# EAGLE design supply (EAGLE 6.3)
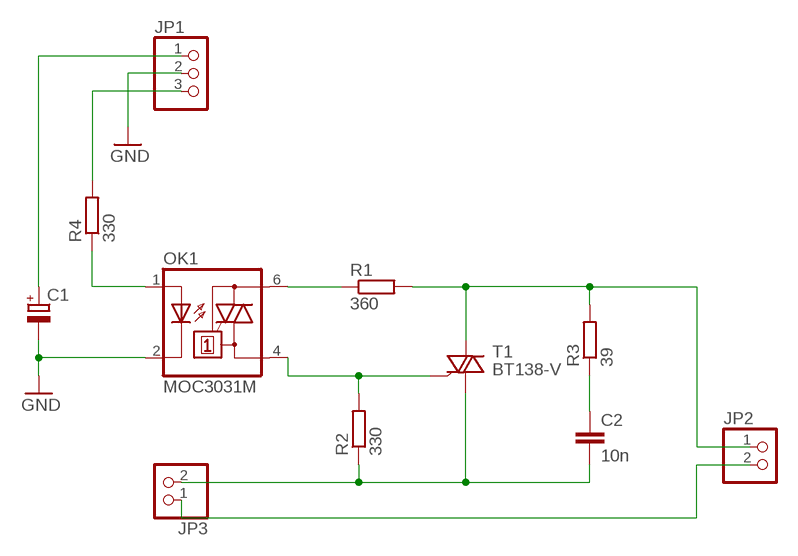
[diagram p0: schematic, sheet 1]

## Parts
C1  CPOL-EUE5-10.5  [E5-10,5]
C2  10n  C-EU102-064X133  [C102-064X133]
JP1  PINHD-1X3  [1X03]
JP2  PINHD-1X2  [1X02]
JP3  PINHD-1X2  [1X02]
OK1  MOC3031M  [DIL06]
R1  360  R-EU_0207/10  [0207/10]
R2  330  R-EU_0207/10  [0207/10]
R3  39  R-EU_0207/10  [0207/10]
R4  330  R-EU_0207/10  [0207/10]
T1  BT138-V  [TO220BV]

## Nets
GND: C1.- JP1.2 OK1.2(C)
N$1: OK1.1(A) R4.1
N$2: OK1.6(A2) R1.1
N$3: JP2.1 R1.2 R3.2 T1.T2(A2)
N$4: OK1.4(A1) R2.2 T1.G
N$5: C2.2 JP3.2 R2.1 T1.T1(A1)
N$6: C2.1 R3.1
N$7: JP1.3 R4.2
N$8: C1.+ JP1.1
N$9: JP2.2 JP3.1

## Library data of the parts
C1 = resistor:CPOL-EU: POLARIZED CAPACITOR, European symbol
C2 = resistor:C-EU: CAPACITOR, European symbol
JP1 = pinhead:PINHD-1X3: PIN HEADER
JP2 JP3 = pinhead:PINHD-1X2: PIN HEADER
OK1 = optocoupler:MOC30*: 6-Pin DIP Zero-Cross Optoisolators Triac Driver Output (250/400 Volt Peak) Source: http://www.fairchildsemi.com/ds/MO/MOC3043-M.pdf; MF: FAIRCHILD SEMICONDUCTOR; MPN: MOC3031M; OC_FARNELL: 9875964; OC_NEWARK: 78K6089
R1-R4 = resistor:R-EU_: RESISTOR, European symbol
T1 = triac:BT138: TRIAC Source: http://www.semiconductors.philips.com BT138_SERIES_2.pdf

## Board
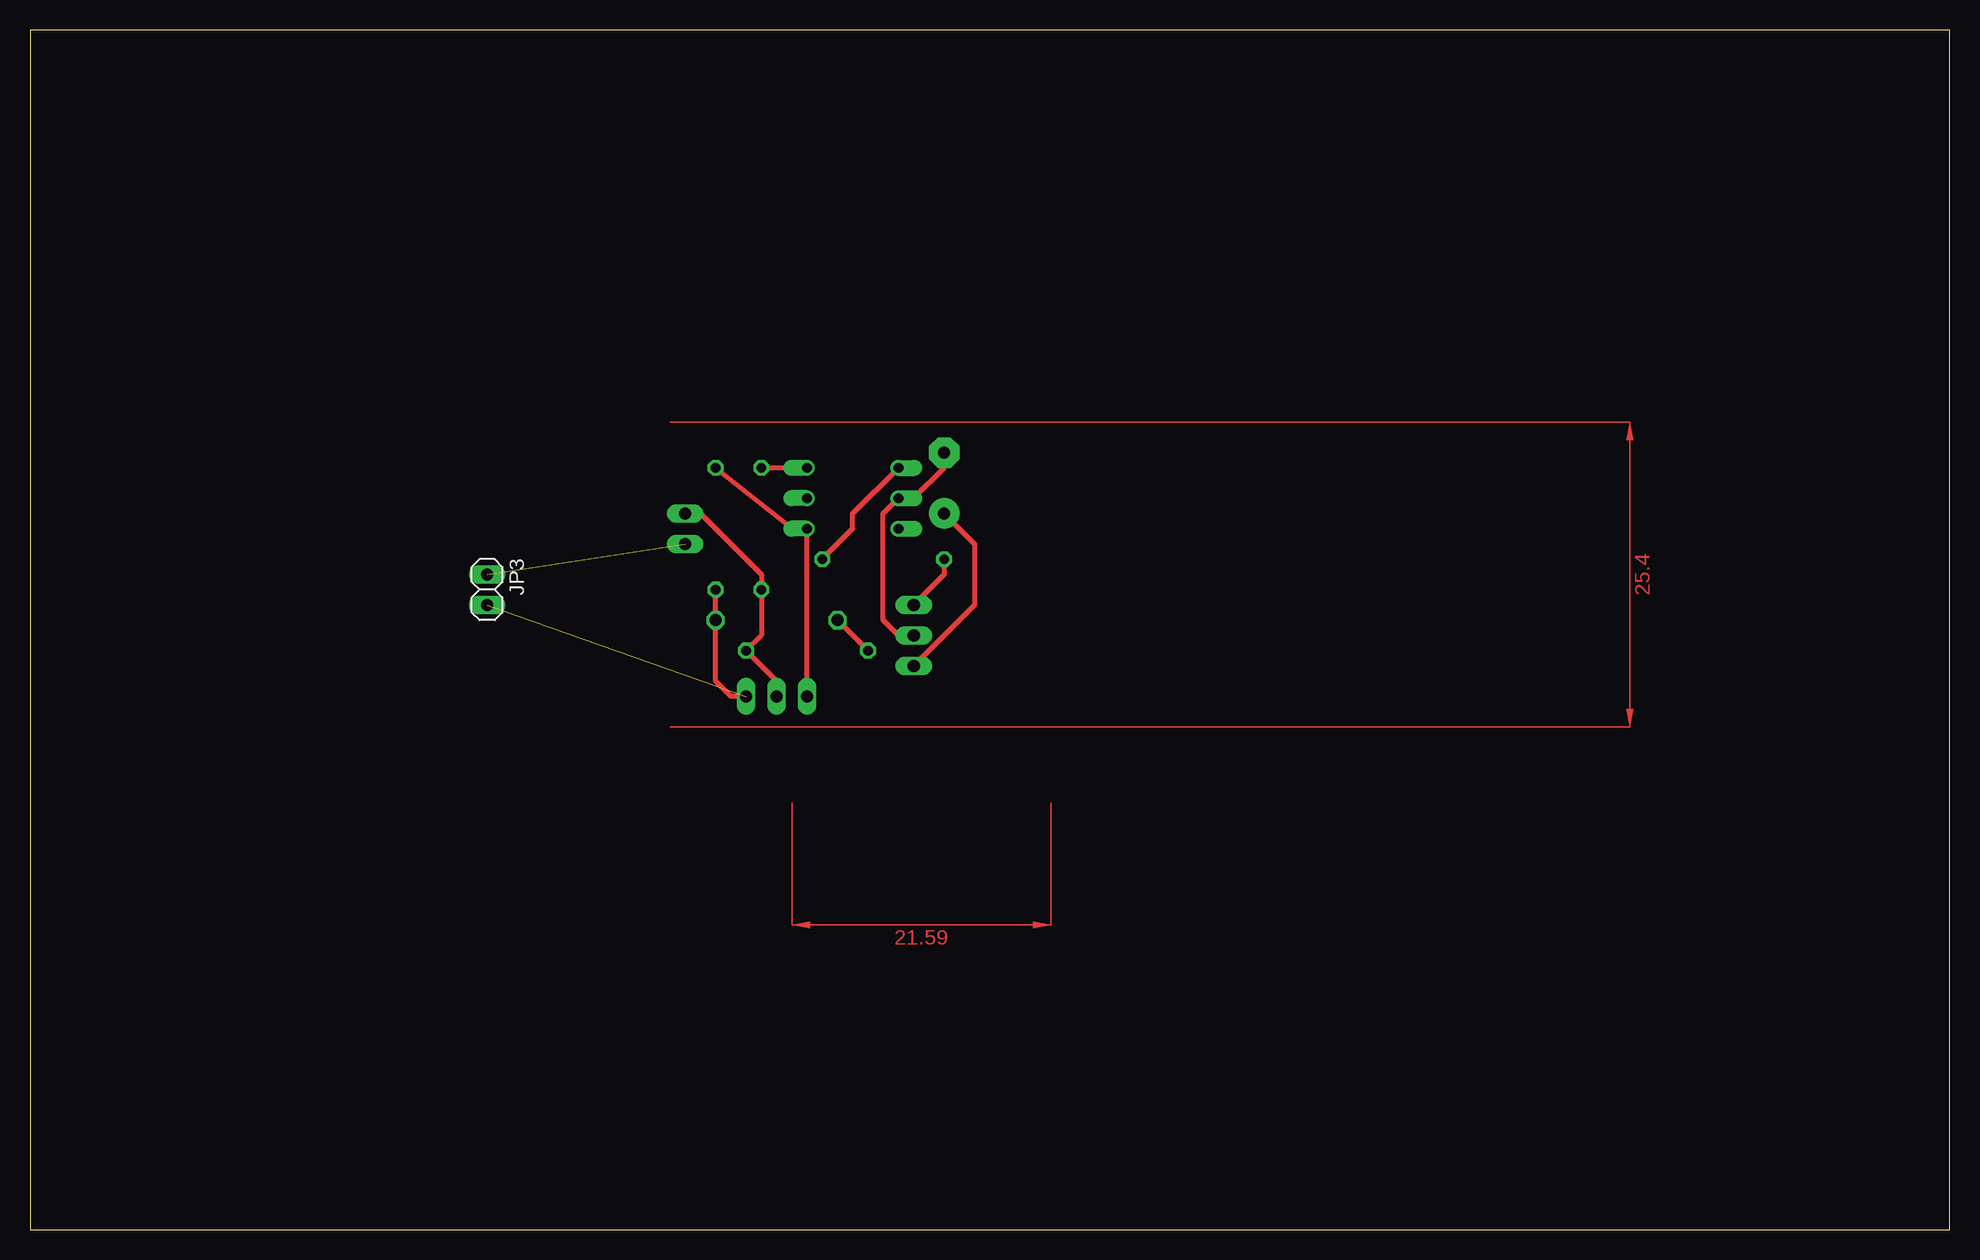
[diagram p1: board, top side]
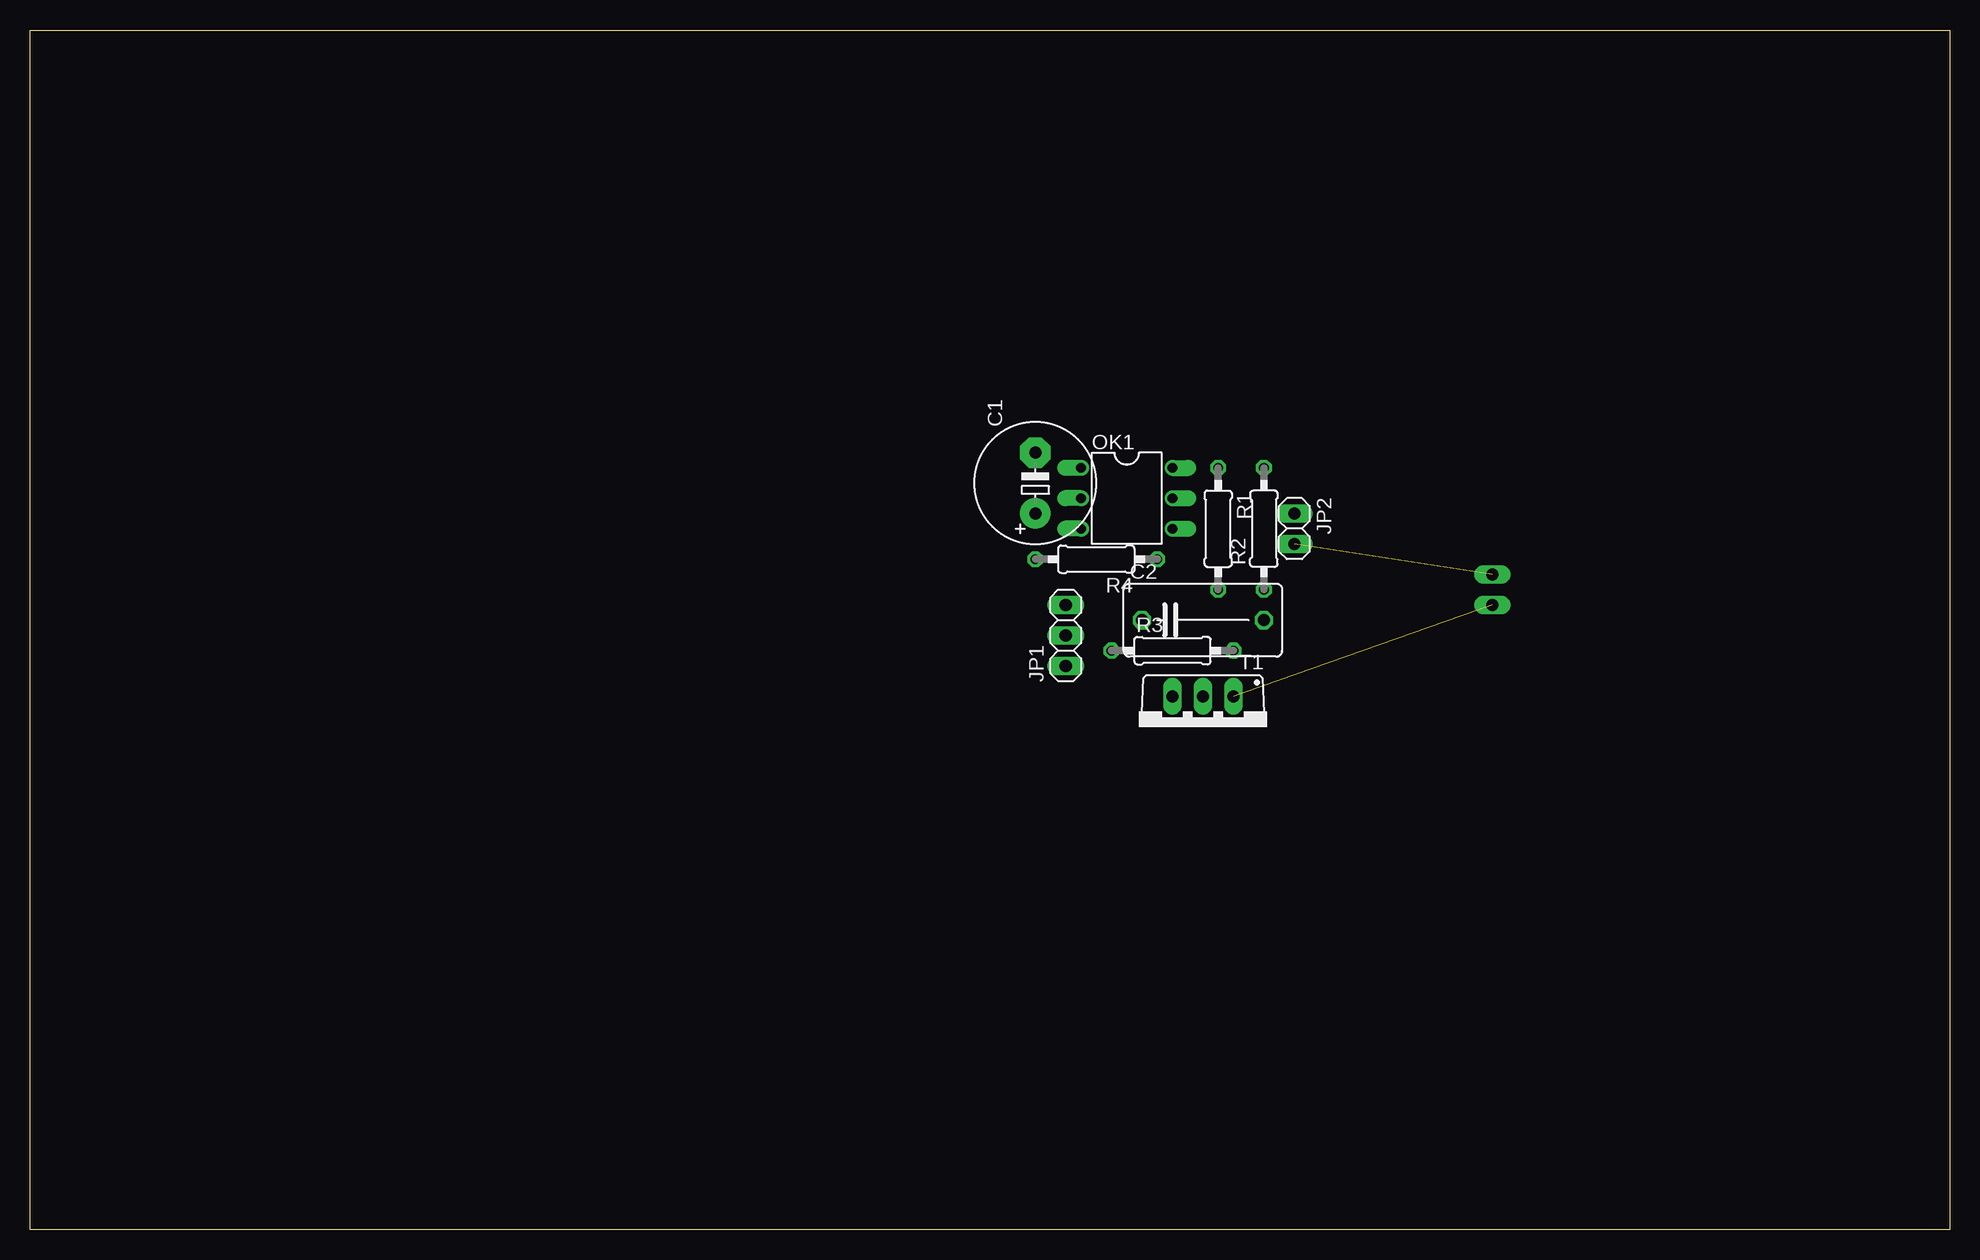
[diagram p2: board, bottom side, seen from below]

Size 160 x 100 mm. Coordinates in mm from the lower left corner, seen from the top.
Outline: 0,0 160,0 160,100 0,100 0,0
Copper layers (1*16): Top 0.035mm / dielectric 1.5mm / Bottom 0.035mm
Design rules "default": minimum track width 10mil, minimum drill 24mil, track to track 8mil, track to pad 8mil, pad to pad 8mil, via to via 8mil, smd to smd 8mil, copper to edge 40mil, drill to drill 8mil, minimum pad ring 10mil, minimum via ring 8mil, stop-mask expansion 4mil, vias tented up to drill 0mil, thermal gap 10mil

### Footprints (pad centres in the part's own frame; a part is rotated, then mirrored left to right if it is on the bottom)
E5-10,5 = drill 1.016 pad 2.54: + -2.54,0 | drill 1.016 pad 2.54 octagon: - 2.54,0
C102-064X133 = drill 1.016 octagon: 1 -5.08,0; 2 5.08,0
1X03 = drill 1.016 long: 1 -2.54,0; 2 0,0; 3 2.54,0
1X02 = drill 1.016 long: 1 -1.27,0; 2 1.27,0
DIL06 = drill 0.813 offset: 1 -2.54,-3.81; 2 0,-3.81; 3 2.54,-3.81; 4 2.54,3.81; 5 0,3.81; 6 -2.54,3.81
0207/10 = drill 0.813 octagon: 1 -5.08,0; 2 5.08,0
TO220BV = drill 1.016 long: G 2.54,-2.54; T1 -2.54,-2.54; T2 0,-2.54

### Placement (x,y rotation side)
C1  76.2,62.23 90 bottom
C2  62.23,50.8 0 bottom
JP1  73.66,49.53 90 bottom
JP2  54.61,58.42 270 bottom
JP3  38.1,53.34 270 top
OK1  68.58,60.96 270 bottom
R1  60.96,58.42 270 bottom
R2  57.15,58.42 90 bottom
R3  64.77,48.26 0 bottom
R4  71.12,55.88 180 bottom
T1  62.23,41.91 180 bottom

### Tracks (layer width: path | path; a pad name or v marks a point on that pad's centre or on a via)
GND
  Top 0.406: C1.- 76.2,63.5 73.66,60.96 OK1.2 71.12,59.69 71.12,50.8 72.39,49.53 JP1.2
N$1
  Top 0.406: R4.1 68.58,58.42 68.58,59.69 OK1.1
N$2
  Top 0.406: OK1.6 R1.1
N$3
  Top 0.406: T1.T2 62.23,45.72 R3.2 60.96,49.53 R1.2 60.96,54.61 55.88,59.69 JP2.1
N$4
  Top 0.406: R2.2 63.5,58.42 OK1.4 T1.G
N$5  (1 unrouted)
  Top 0.406: T1.T1 58.42,44.45 57.15,45.72 C2.2 R2.1
N$6
  Top 0.406: R3.1 C2.1
N$7
  Top 0.406: R4.2 76.2,54.61 JP1.3
N$8
  Top 0.406: C1.+ 78.74,57.15 78.74,52.07 JP1.1
N$9  (1 unrouted)
(copper drawn outside any net)
  shapes: Top area x2